# Altium schematic sheet TI_MCU.SchDoc
size 500 x 500 mm
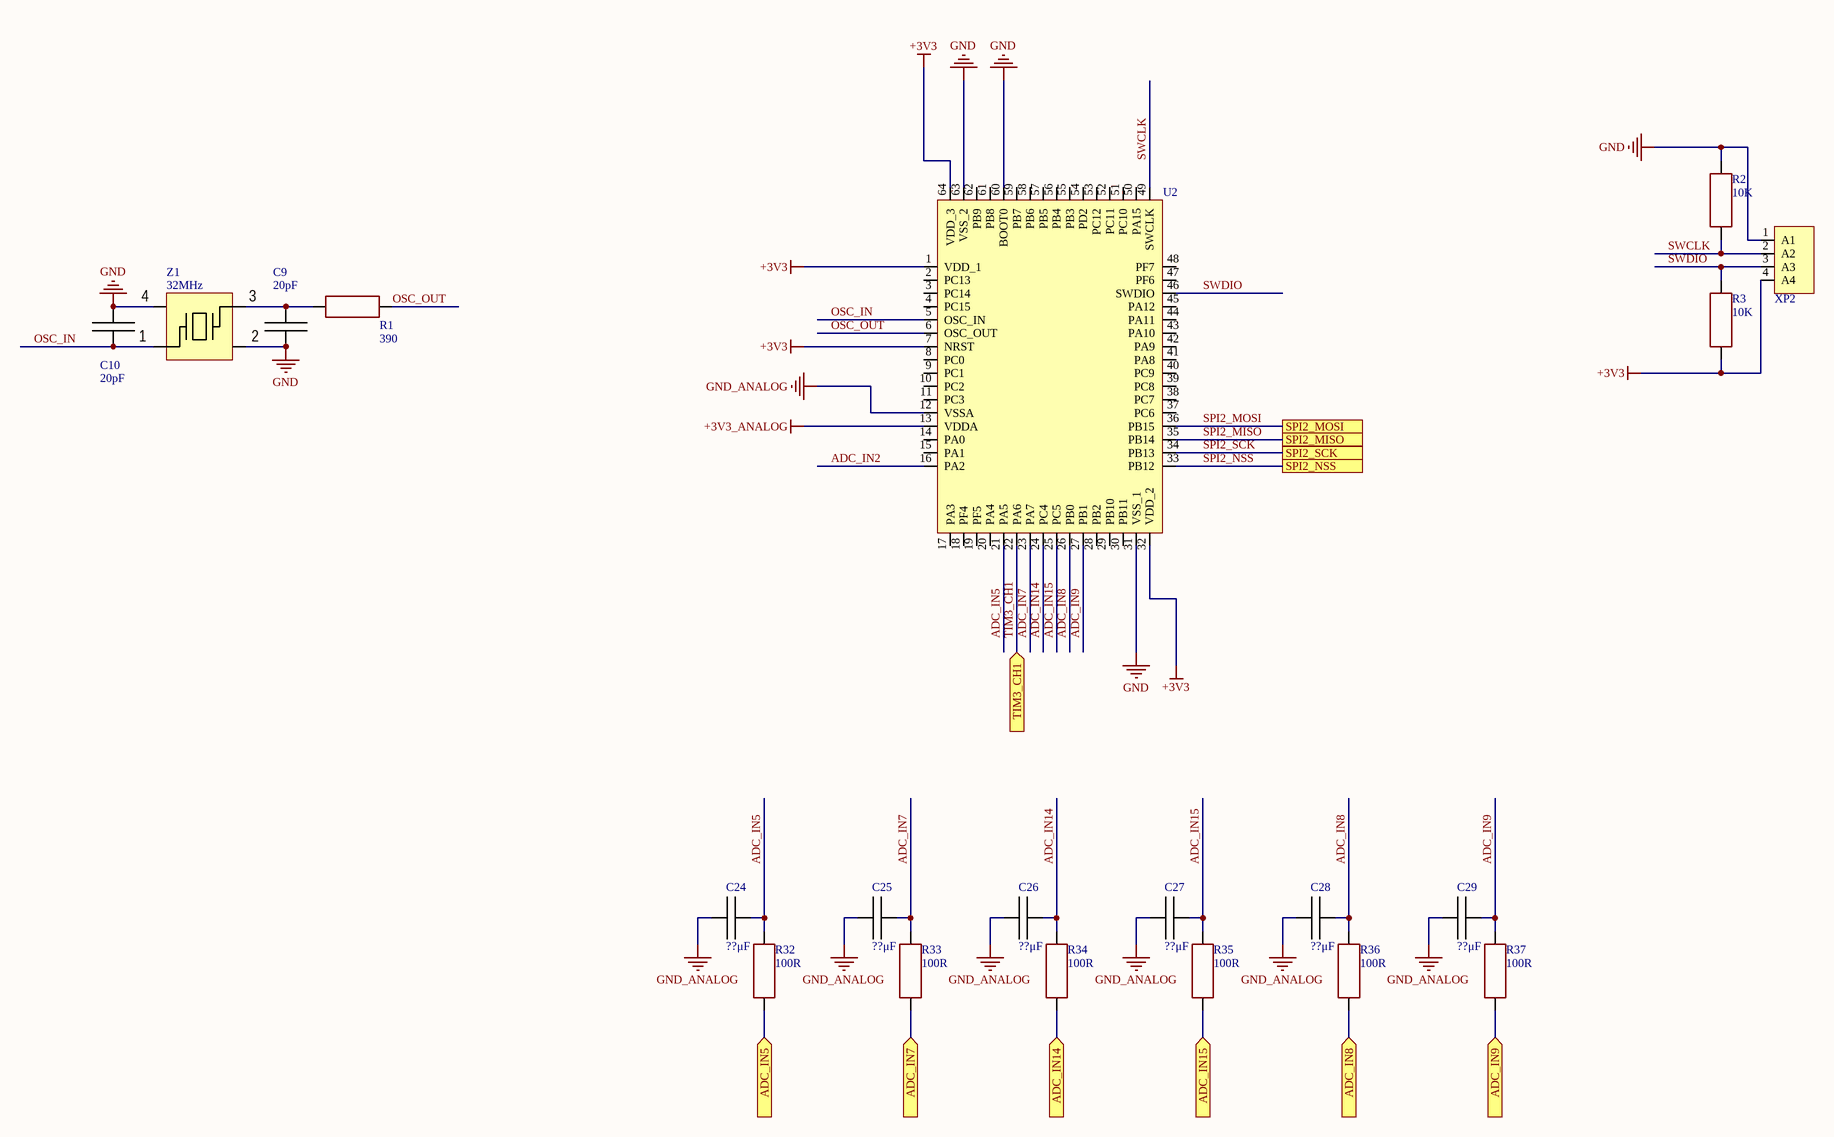
[diagram p0: TI_MCU.SchDoc]

## Parts
C9  value 20pF  [CAP: 0603]  (hidden comment: Cap_0603)
C10  value 20pF  [CAP: 0603]  (hidden comment: Cap_0603)
C24  value ??μF  [CAP: 0603]  (hidden comment: Cap_0603)
C25  value ??μF  [CAP: 0603]  (hidden comment: Cap_0603)
C26  value ??μF  [CAP: 0603]  (hidden comment: Cap_0603)
C27  value ??μF  [CAP: 0603]  (hidden comment: Cap_0603)
C28  value ??μF  [CAP: 0603]  (hidden comment: Cap_0603)
C29  value ??μF  [CAP: 0603]  (hidden comment: Cap_0603)
R1  value 390  [RES: 0603]  (hidden comment: Resistor_0603)
R2  value 10K  [RES: 0603]  (hidden comment: Resistor_0603)
R3  value 10K  [RES: 0603]  (hidden comment: Resistor_0603)
R32  value 100R  [RES: 0603]  (hidden comment: Resistor_0603)
R33  value 100R  [RES: 0603]  (hidden comment: Resistor_0603)
R34  value 100R  [RES: 0603]  (hidden comment: Resistor_0603)
R35  value 100R  [RES: 0603]  (hidden comment: Resistor_0603)
R36  value 100R  [RES: 0603]  (hidden comment: Resistor_0603)
R37  value 100R  [RES: 0603]  (hidden comment: Resistor_0603)
U2  STM32F030R8T6TR  [LQFP-64]  (value not drawn)
XP2  PLS-6 (DS1021-1x6)  [PLS-4 (DS1021-1x4)]  (value not drawn)
Z1  value 32MHz  [OSC: 2520]  (hidden comment: ECS-320-10-36B2-CTN-TR)

## Ports
ADC_IN5 (in), ADC_IN7 (in), ADC_IN8 (in), ADC_IN9 (in), ADC_IN14 (in), ADC_IN15 (in), SPI2_MISO, SPI2_MOSI, SPI2_NSS, SPI2_SCK, TIM3_CH1 (in)

## Nets
+3V3: R3.2 U2.1(VDD_1) U2.7(NRST) U2.32(VDD_2) U2.64(VDD_3) XP2.4(A4)
+3V3_ANALOG: U2.13(VDDA)
GND: C9.1 C10.2 R2.1 U2.31(VSS_1) U2.60(BOOT0) U2.63(VSS_2) XP2.1(A1) Z1.2 Z1.4
GND_ANALOG: C24.1 C25.1 C26.1 C27.1 C28.1 C29.1 U2.12(VSSA)
ADC_IN2: U2.16(PA2)
ADC_IN5: C24.2 R32.2 U2.21(PA5)
ADC_IN5: R32.1 ; port ADC_IN5  [a separate net that carries the same name]
ADC_IN7: C25.2 R33.2 U2.23(PA7)
ADC_IN7: R33.1 ; port ADC_IN7  [a separate net that carries the same name]
ADC_IN8: C28.2 R36.2 U2.26(PB0)
ADC_IN8: R36.1 ; port ADC_IN8  [a separate net that carries the same name]
ADC_IN9: C29.2 R37.2 U2.27(PB1)
ADC_IN9: R37.1 ; port ADC_IN9  [a separate net that carries the same name]
ADC_IN14: C26.2 R34.2 U2.24(PC4)
ADC_IN14: R34.1 ; port ADC_IN14  [a separate net that carries the same name]
ADC_IN15: C27.2 R35.2 U2.25(PC5)
ADC_IN15: R35.1 ; port ADC_IN15  [a separate net that carries the same name]
OSC_IN: C10.1 U2.5(OSC_IN) Z1.1
OSC_OUT: R1.2 U2.6(OSC_OUT)
SPI2_MISO: U2.35(PB14) ; port SPI2_MISO
SPI2_MOSI: U2.36(PB15) ; port SPI2_MOSI
SPI2_NSS: U2.33(PB12) ; port SPI2_NSS
SPI2_SCK: U2.34(PB13) ; port SPI2_SCK
SWCLK: R2.2 U2.49(SWCLK) XP2.2(A2)
SWDIO: R3.1 U2.46(SWDIO) XP2.3(A3)
TIM3_CH1: U2.22(PA6) ; port TIM3_CH1
NetC9_2: C9.2 R1.1 Z1.3

Not connected (* = marked no-connect by the designer): U2 2(PC13) 3(PC14) 4(PC15) 8(PC0) 9(PC1) 10(PC2) 11(PC3) 14(PA0) 15(PA1) 17(PA3) 18(PF4) 19(PF5) 20(PA4) 28(PB2) 29(PB10) 30(PB11) 37(PC6) 38(PC7) 39(PC8) 40(PC9) 41(PA8) 42(PA9) 43(PA10) 44(PA11) 45(PA12) 47(PF6) 48(PF7) 50(PA15) 51(PC10) 52(PC11) 53(PC12) 54(PD2) 55(PB3) 56(PB4) 57(PB5) 58(PB6) 59(PB7) 61(PB8) 62(PB9)

## Library data of the parts
C9 C10 = Cap_0603: TypeDielectric: X7R(X5R); Voltage: 50V; Package/Case: 0603; Temperature: -55...+125°C(-55...+85°C); Product Category: Capacitors
C24-C29 = Cap_0603: TypeDielectric: X7R(X5R); Voltage: ??V; Package/Case: 0603; Temperature: -55...+125°C(-55...+85°C); Product Category: Capacitors
R1-R3 = Resistor_0603: Power: 0.1W; Tolerance: ±1%; Package/Case: 0603; Temperature: -55...+125°C; Product Category: Resistors
R32-R37 = Resistor_0603: Power: 0.1W; Tolerance: ±5%; Package/Case: 0603; Temperature: -55...+125°C; Product Category: Resistors
U2 = STM32F030R8T6TR: MCU Mainstream Arm Cortex-M0 Value line MCU 64 Kbytes of Flash , 48 MHz CPU; Manufacturer: STMicroelectronics; Datasheet: https://www.st.com/resource/en/datasheet/stm32f030r8.pdf; HelpURL: https://eu.mouser.com/ProductDetail/STMicroelectronics/STM32F030R8T6TR?qs=s5SkPsIz10%252B%252B1w15QiyTpQ%3D%3D; Package/Case: LQFP-64; Product Category: Microcontrollers
XP2 = PLS-4 (DS1021-1x4): Board to Board, Surface Mount, Single row, 6 Positions, 2.54mm, Vertical.; Manufacturer: Connfly; Datasheet: https://static.chipdip.ru/lib/977/DOC005977245.pdf; HelpURL: https://www.chipdip.by/product/pls-4; Product Category: Connectors
Z1 = ECS-320-10-36B2-CTN-TR: Crystal 32.000 MHz 10 pF +/-10 +/-20 -40 +85 C +/-2 ppm Max.; Manufacturer: ECS; Package/Case: 2520; HelpURL: https://eu.mouser.com/ProductDetail/ECS/ECS-320-10-36B2-CTN-TR?qs=QNEnbhJQKvbusIFiAH6chw%3D%3D; Temperature: -40...+85°C; Datasheet: https://eu.mouser.com/datasheet/2/122/ECX_2236B2-2400583.pdf; Product Category: Crystals